# Altium schematic sheet Filter.SchDoc
size 127 x 38 mm
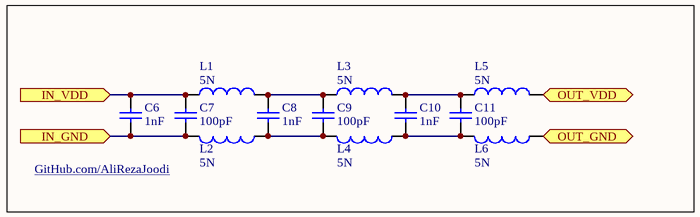
[diagram p0: Filter.SchDoc]

## Parts
C6  1nF  [CAPNTO2.54-3.56x2.03]
C7  100pF  [CAPNTO2.54-3.56x2.03]
C8  1nF  [CAPNTO2.54-3.56x2.03]
C9  100pF  [CAPNTO2.54-3.56x2.03]
C10  1nF  [CAPNTO2.54-3.56x2.03]
C11  100pF  [CAPNTO2.54-3.56x2.03]
L1  5N  [CAPPR5-6.3x11]
L2  5N  [CAPPR5-6.3x11]
L3  5N  [CAPPR5-6.3x11]
L4  5N  [CAPPR5-6.3x11]
L5  5N  [CAPPR5-6.3x11]
L6  5N  [CAPPR5-6.3x11]

## Ports
IN_GND (in), IN_VDD (in), OUT_GND (out), OUT_VDD (out)

## Nets
IN_GND: C6.1 C7.1 L2.2 ; port IN_GND
IN_VDD: C6.2 C7.2 L1.2 ; port IN_VDD
OUT_GND: L6.1 ; port OUT_GND
OUT_VDD: L5.1 ; port OUT_VDD
NetC8_1: C8.1 C9.1 L2.1 L4.2
NetC8_2: C8.2 C9.2 L1.1 L3.2
NetC10_1: C10.1 C11.1 L4.1 L6.2
NetC10_2: C10.2 C11.2 L3.1 L5.2

## Notes on the sheet
- GitHub.com/AliRezaJoodi

## Library data of the parts
C6-C11 = Cap: Capacitor; Manufacturer: Generic Components; Class I: Passive; Published: 8-Jun-2000; Revision: July-2002: Re-released for DXP Platform.; Publisher: Altium Limited; Class II: Capacitor
L1-L6 = Inductor: Manufacturer: Generic Components; Class I: Passive; Published: 8-Jun-2000; Revision: July-2002: Re-released for DXP Platform.; Publisher: Altium Limited; Class II: Inductor; Supplier 1: Newark